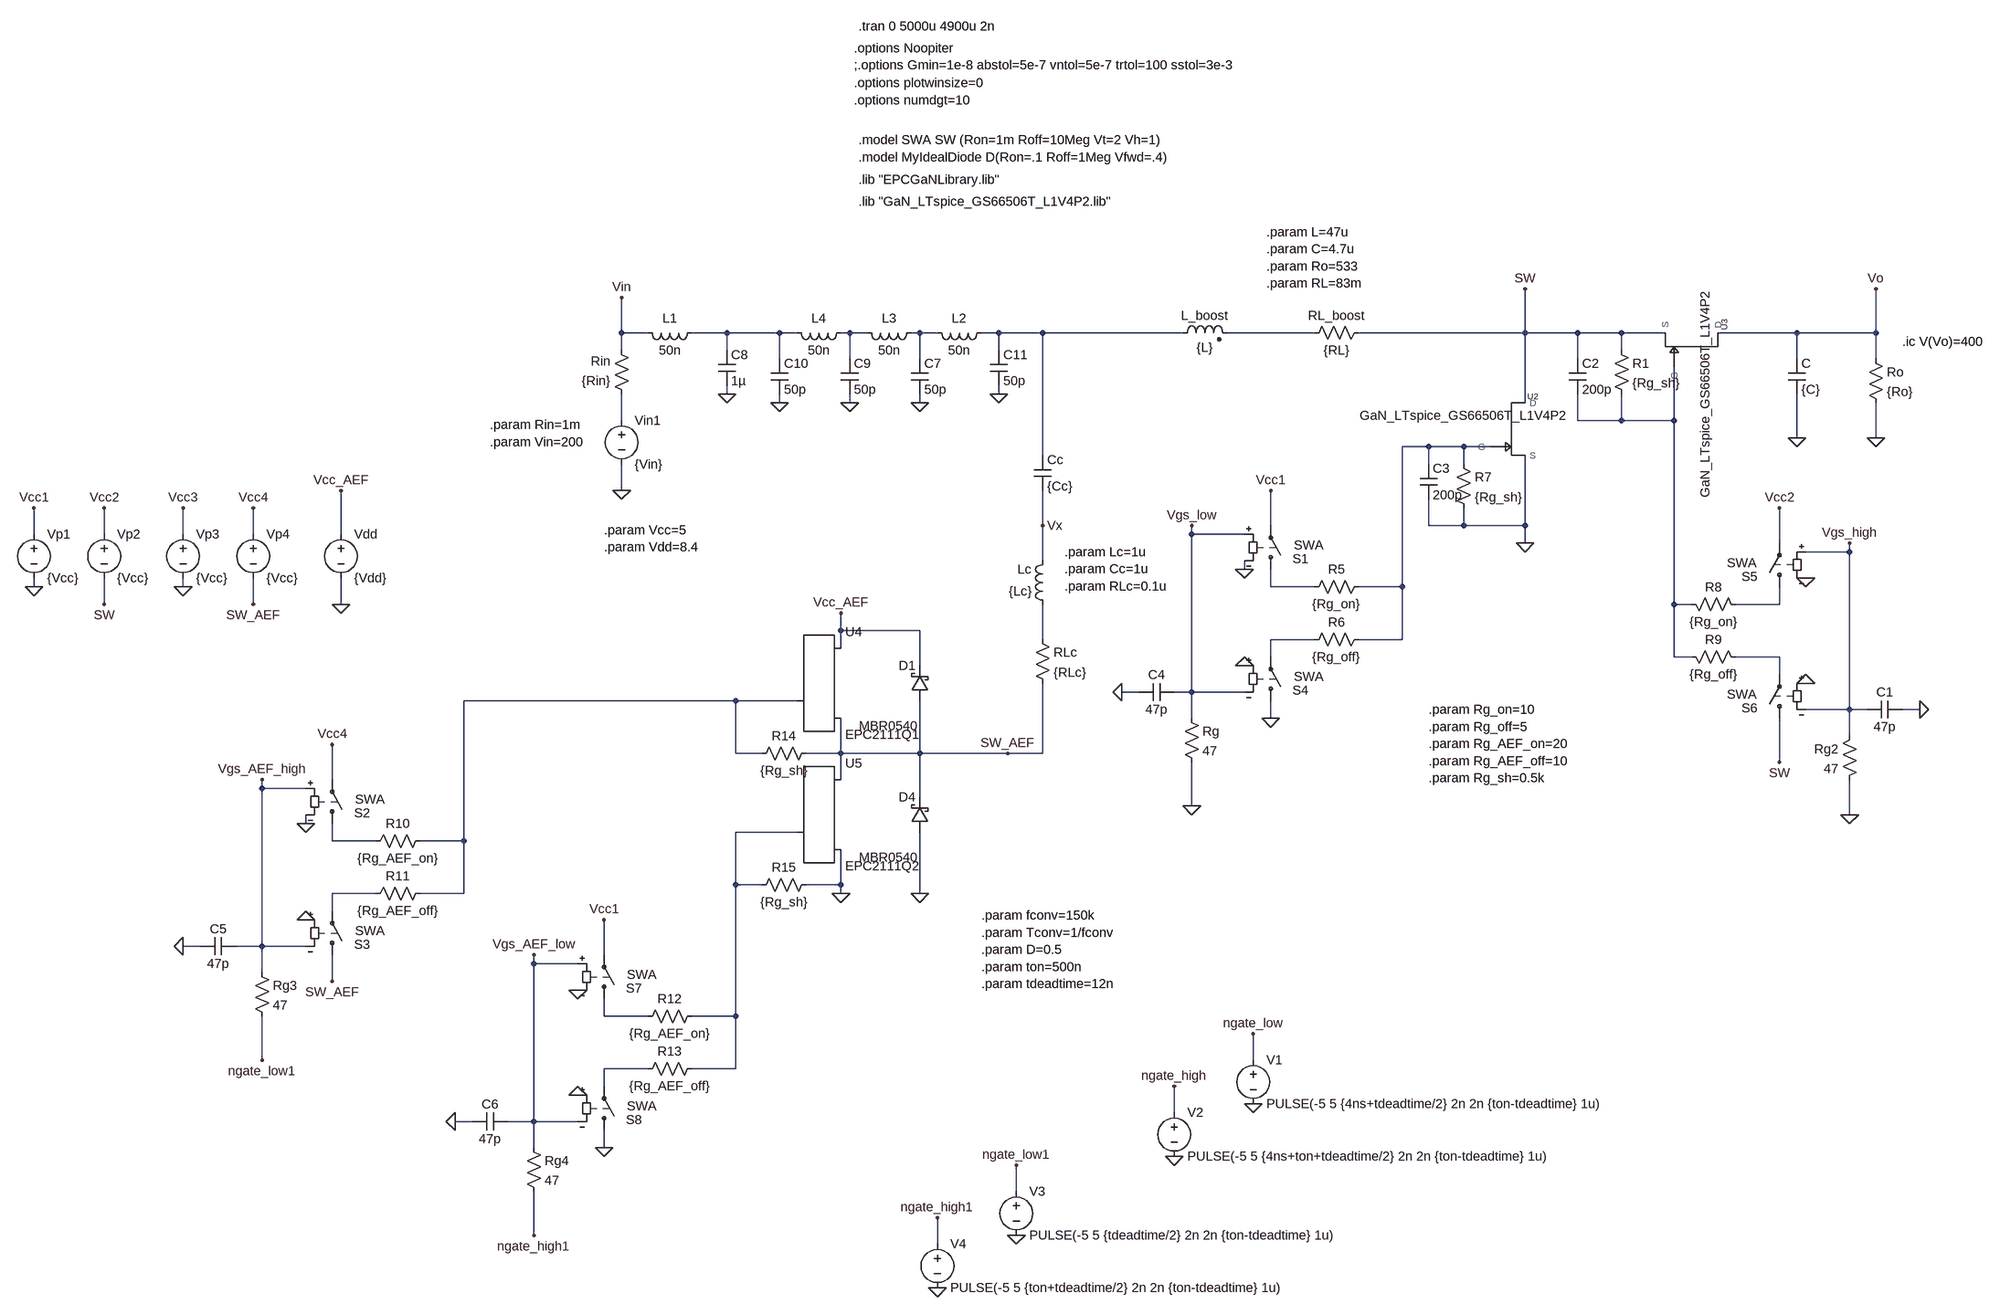
[diagram p0: schematic Boost converter with LC filter -20220425 - 1MHz.asc]
Boost converter with LC filter -20220425 - 1MHz.asc, the LTspice schematic file:
Version 4
SHEET 1 4440 3892
WIRE -1504 640 -1504 576
WIRE -1456 640 -1504 640
WIRE -1312 640 -1376 640
WIRE -1216 640 -1312 640
WIRE -1184 640 -1216 640
WIRE -1088 640 -1104 640
WIRE -1056 640 -1088 640
WIRE -960 640 -976 640
WIRE -928 640 -960 640
WIRE -816 640 -848 640
WIRE -736 640 -816 640
WIRE -480 640 -736 640
WIRE -240 640 -400 640
WIRE 144 640 144 560
WIRE 144 640 -160 640
WIRE 240 640 144 640
WIRE 320 640 240 640
WIRE 400 640 320 640
WIRE 640 640 496 640
WIRE 784 640 784 560
WIRE 784 640 640 640
WIRE -1504 672 -1504 640
WIRE -1312 672 -1312 640
WIRE -816 672 -816 640
WIRE 320 672 320 640
WIRE -1216 688 -1216 640
WIRE -1088 688 -1088 640
WIRE -960 688 -960 640
WIRE 240 688 240 640
WIRE 640 688 640 640
WIRE 784 688 784 640
WIRE -1312 752 -1312 736
WIRE -816 752 -816 736
WIRE -1216 768 -1216 752
WIRE -1088 768 -1088 752
WIRE -960 768 -960 752
WIRE 144 768 144 640
WIRE -1504 800 -1504 752
WIRE 240 800 240 752
WIRE 320 800 320 752
WIRE 320 800 240 800
WIRE 416 800 416 704
WIRE 416 800 320 800
WIRE 640 832 640 752
WIRE 784 832 784 768
WIRE -32 848 -80 848
WIRE 32 848 -32 848
WIRE 80 848 32 848
WIRE -736 864 -736 640
WIRE -32 880 -32 848
WIRE 32 880 32 848
WIRE -1504 928 -1504 880
WIRE -736 992 -736 928
WIRE -320 992 -320 928
WIRE -32 992 -32 944
WIRE 32 992 32 960
WIRE 32 992 -32 992
WIRE 144 992 144 864
WIRE 144 992 32 992
WIRE -2576 1008 -2576 960
WIRE -2448 1008 -2448 960
WIRE -2304 1008 -2304 960
WIRE -2176 1008 -2176 960
WIRE -2016 1008 -2016 928
WIRE -464 1008 -464 992
WIRE -368 1008 -464 1008
WIRE 144 1024 144 992
WIRE 608 1024 608 960
WIRE 736 1040 736 1024
WIRE 736 1040 656 1040
WIRE -736 1056 -736 992
WIRE -368 1072 -368 1056
WIRE -2576 1104 -2576 1088
WIRE -2304 1104 -2304 1088
WIRE -320 1104 -320 1072
WIRE -240 1104 -320 1104
WIRE -80 1104 -80 848
WIRE -80 1104 -160 1104
WIRE -2448 1136 -2448 1088
WIRE -2176 1136 -2176 1088
WIRE -2016 1136 -2016 1088
WIRE 416 1136 416 800
WIRE 448 1136 416 1136
WIRE 608 1136 608 1104
WIRE 608 1136 528 1136
WIRE -1104 1184 -1104 1152
WIRE -960 1184 -1104 1184
WIRE -736 1200 -736 1136
WIRE -240 1200 -320 1200
WIRE -80 1200 -80 1104
WIRE -80 1200 -160 1200
WIRE -1104 1216 -1104 1184
WIRE -320 1232 -320 1200
WIRE 416 1232 416 1136
WIRE 448 1232 416 1232
WIRE 608 1232 528 1232
WIRE -960 1248 -960 1184
WIRE 608 1264 608 1232
WIRE -560 1296 -592 1296
WIRE -464 1296 -464 1008
WIRE -464 1296 -496 1296
WIRE -368 1296 -464 1296
WIRE -1296 1312 -1792 1312
WIRE -1184 1312 -1296 1312
WIRE 736 1328 736 1040
WIRE 736 1328 656 1328
WIRE 768 1328 736 1328
WIRE 864 1328 832 1328
WIRE -464 1344 -464 1296
WIRE -320 1344 -320 1312
WIRE 736 1376 736 1328
WIRE -1296 1408 -1296 1312
WIRE -1248 1408 -1296 1408
WIRE -1104 1408 -1104 1344
WIRE -1104 1408 -1168 1408
WIRE -960 1408 -960 1312
WIRE -960 1408 -1104 1408
WIRE -800 1408 -960 1408
WIRE -736 1408 -736 1280
WIRE -736 1408 -800 1408
WIRE 608 1424 608 1344
WIRE -2032 1456 -2032 1392
WIRE -1104 1456 -1104 1408
WIRE -2160 1472 -2160 1456
WIRE -2080 1472 -2160 1472
WIRE -960 1488 -960 1408
WIRE -464 1504 -464 1424
WIRE 736 1520 736 1456
WIRE -2080 1536 -2080 1520
WIRE -1184 1552 -1296 1552
WIRE -2032 1568 -2032 1536
WIRE -1952 1568 -2032 1568
WIRE -1792 1568 -1792 1312
WIRE -1792 1568 -1872 1568
WIRE -1296 1648 -1296 1552
WIRE -1248 1648 -1296 1648
WIRE -1104 1648 -1104 1584
WIRE -1104 1648 -1168 1648
WIRE -1952 1664 -2032 1664
WIRE -1792 1664 -1792 1568
WIRE -1792 1664 -1872 1664
WIRE -1104 1664 -1104 1648
WIRE -960 1664 -960 1552
WIRE -2032 1696 -2032 1664
WIRE -2272 1760 -2304 1760
WIRE -2160 1760 -2160 1472
WIRE -2160 1760 -2208 1760
WIRE -2080 1760 -2160 1760
WIRE -1536 1776 -1536 1712
WIRE -1664 1792 -1664 1776
WIRE -1584 1792 -1664 1792
WIRE -2160 1808 -2160 1760
WIRE -2032 1824 -2032 1776
WIRE -1536 1888 -1536 1856
WIRE -1456 1888 -1536 1888
WIRE -1296 1888 -1296 1648
WIRE -1296 1888 -1376 1888
WIRE -2160 1968 -2160 1888
WIRE -352 1968 -352 1920
WIRE -1456 1984 -1536 1984
WIRE -1296 1984 -1296 1888
WIRE -1296 1984 -1376 1984
WIRE -1536 2016 -1536 1984
WIRE -496 2064 -496 2016
WIRE -1776 2080 -1808 2080
WIRE -1664 2080 -1664 1792
WIRE -1664 2080 -1712 2080
WIRE -1584 2080 -1664 2080
WIRE -1664 2128 -1664 2080
WIRE -1536 2128 -1536 2096
WIRE -784 2208 -784 2160
WIRE -1664 2288 -1664 2208
WIRE -928 2304 -928 2256
FLAG -1504 928 0
FLAG -368 1072 0
FLAG 640 832 0
FLAG 784 832 0
FLAG -1504 576 Vin
FLAG -464 992 Vgs_low
FLAG 784 560 Vo
FLAG -1104 1152 Vcc_AEF
FLAG -2016 1136 0
FLAG -2016 928 Vcc_AEF
FLAG -736 992 Vx
FLAG -2576 1104 0
FLAG 144 1024 0
FLAG 144 560 SW
FLAG -2576 960 Vcc1
FLAG -2448 960 Vcc2
FLAG -2304 1104 0
FLAG -2304 960 Vcc3
FLAG -2176 960 Vcc4
FLAG -320 928 Vcc1
FLAG -320 1344 0
FLAG 736 1024 Vgs_high
FLAG 608 960 Vcc2
FLAG 608 1424 SW
FLAG -2448 1136 SW
FLAG -1104 1664 0
FLAG -960 1664 0
FLAG -2080 1536 0
FLAG -2160 1456 Vgs_AEF_high
FLAG -2032 1392 Vcc4
FLAG -800 1408 SW_AEF
FLAG -1664 1776 Vgs_AEF_low
FLAG -1536 1712 Vcc1
FLAG -1536 2128 0
FLAG -2176 1136 SW_AEF
FLAG -2032 1824 SW_AEF
FLAG -352 2048 0
FLAG 864 1328 0
FLAG -592 1296 0
FLAG -2160 1968 ngate_low1
FLAG -1664 2288 ngate_high1
FLAG -2304 1760 0
FLAG -1808 2080 0
FLAG 656 1280 0
FLAG -368 1248 0
FLAG -2080 1712 0
FLAG -1584 1840 0
FLAG -1584 2032 0
FLAG 656 1088 0
FLAG -352 1920 ngate_low
FLAG -496 2144 0
FLAG -496 2016 ngate_high
FLAG -784 2288 0
FLAG -784 2160 ngate_low1
FLAG -928 2384 0
FLAG -928 2256 ngate_high1
FLAG -960 768 0
FLAG -464 1504 0
FLAG 736 1520 0
FLAG -1312 752 0
FLAG -1088 768 0
FLAG -1216 768 0
FLAG -816 752 0
SYMBOL voltage -1504 784 R0
WINDOW 123 0 0 Left 2
WINDOW 39 0 0 Left 2
SYMATTR InstName Vin1
SYMATTR Value {Vin}
SYMBOL ind2 -496 656 R270
WINDOW 0 32 56 VTop 2
WINDOW 3 5 56 VBottom 2
SYMATTR InstName L_boost
SYMATTR Value {L}
SYMATTR Type ind
SYMBOL res -1488 768 R180
WINDOW 0 36 76 Left 2
WINDOW 3 36 40 Left 2
SYMATTR InstName Rin
SYMATTR Value {Rin}
SYMBOL sw -320 1088 M180
WINDOW 0 40 35 Left 2
WINDOW 3 42 60 Left 2
SYMATTR InstName S1
SYMATTR Value SWA
SYMBOL cap 624 688 R0
SYMATTR InstName C
SYMATTR Value {C}
SYMBOL res 768 672 R0
SYMATTR InstName Ro
SYMATTR Value {Ro}
SYMBOL res -480 1328 R0
SYMATTR InstName Rg
SYMATTR Value 47
SYMBOL ind -720 1152 R180
WINDOW 0 36 80 Left 2
WINDOW 3 36 40 Left 2
SYMATTR InstName Lc
SYMATTR Value {Lc}
SYMBOL cap -752 864 R0
SYMATTR InstName Cc
SYMATTR Value {Cc}
SYMBOL voltage -2016 992 R0
WINDOW 123 0 0 Left 2
WINDOW 39 0 0 Left 2
SYMATTR InstName Vdd
SYMATTR Value {Vdd}
SYMBOL voltage -2576 992 R0
WINDOW 123 0 0 Left 2
WINDOW 39 0 0 Left 2
SYMATTR InstName Vp1
SYMATTR Value {Vcc}
SYMBOL GaN_LTspice_GS66506T_L1V4P2 96 816 R0
SYMATTR InstName U2
SYMBOL GaN_LTspice_GS66506T_L1V4P2 448 688 M270
SYMATTR InstName U3
SYMBOL EPCGaN -1184 1312 R0
SYMATTR InstName U4
SYMATTR Value EPC2111Q1
SYMBOL EPCGaN -1184 1552 R0
SYMATTR InstName U5
SYMATTR Value EPC2111Q2
SYMBOL voltage -2448 992 R0
WINDOW 123 0 0 Left 2
WINDOW 39 0 0 Left 2
SYMATTR InstName Vp2
SYMATTR Value {Vcc}
SYMBOL voltage -2304 992 R0
WINDOW 123 0 0 Left 2
WINDOW 39 0 0 Left 2
SYMATTR InstName Vp3
SYMATTR Value {Vcc}
SYMBOL voltage -2176 992 R0
WINDOW 123 0 0 Left 2
WINDOW 39 0 0 Left 2
SYMATTR InstName Vp4
SYMATTR Value {Vcc}
SYMBOL res -144 1088 R90
WINDOW 0 0 56 VBottom 2
WINDOW 3 32 56 VTop 2
SYMATTR InstName R5
SYMATTR Value {Rg_on}
SYMBOL sw -320 1328 M180
WINDOW 0 40 35 Left 2
WINDOW 3 42 60 Left 2
SYMATTR InstName S4
SYMATTR Value SWA
SYMBOL res -144 1184 R90
WINDOW 0 0 56 VBottom 2
WINDOW 3 32 56 VTop 2
SYMATTR InstName R6
SYMATTR Value {Rg_off}
SYMBOL res 16 864 R0
SYMATTR InstName R7
SYMATTR Value {Rg_sh}
SYMBOL sw 608 1120 R180
WINDOW 0 40 35 Left 2
WINDOW 3 42 60 Left 2
SYMATTR InstName S5
SYMATTR Value SWA
SYMBOL res 752 1360 M0
SYMATTR InstName Rg2
SYMATTR Value 47
SYMBOL res 432 1120 M90
WINDOW 0 0 56 VBottom 2
WINDOW 3 32 56 VTop 2
SYMATTR InstName R8
SYMATTR Value {Rg_on}
SYMBOL sw 608 1360 R180
WINDOW 0 40 35 Left 2
WINDOW 3 42 60 Left 2
SYMATTR InstName S6
SYMATTR Value SWA
SYMBOL res 432 1216 M90
WINDOW 0 0 56 VBottom 2
WINDOW 3 32 56 VTop 2
SYMATTR InstName R9
SYMATTR Value {Rg_off}
SYMBOL schottky -944 1312 R180
WINDOW 0 24 64 Left 2
WINDOW 3 20 -46 Left 2
SYMATTR InstName D1
SYMATTR Value MBR0540
SYMATTR Description Diode
SYMATTR Type diode
SYMBOL schottky -944 1552 R180
WINDOW 0 24 64 Left 2
WINDOW 3 20 -46 Left 2
SYMATTR InstName D4
SYMATTR Value MBR0540
SYMATTR Description Diode
SYMATTR Type diode
SYMBOL sw -2032 1552 M180
WINDOW 0 40 35 Left 2
WINDOW 3 42 60 Left 2
SYMATTR InstName S2
SYMATTR Value SWA
SYMBOL res -2176 1792 R0
SYMATTR InstName Rg3
SYMATTR Value 47
SYMBOL res -1856 1552 R90
WINDOW 0 0 56 VBottom 2
WINDOW 3 32 56 VTop 2
SYMATTR InstName R10
SYMATTR Value {Rg_AEF_on}
SYMBOL sw -2032 1792 M180
WINDOW 0 40 35 Left 2
WINDOW 3 42 60 Left 2
SYMATTR InstName S3
SYMATTR Value SWA
SYMBOL res -1856 1648 R90
WINDOW 0 0 56 VBottom 2
WINDOW 3 32 56 VTop 2
SYMATTR InstName R11
SYMATTR Value {Rg_AEF_off}
SYMBOL sw -1536 1872 M180
WINDOW 0 40 35 Left 2
WINDOW 3 42 60 Left 2
SYMATTR InstName S7
SYMATTR Value SWA
SYMBOL res -1680 2112 R0
SYMATTR InstName Rg4
SYMATTR Value 47
SYMBOL res -1360 1872 R90
WINDOW 0 0 56 VBottom 2
WINDOW 3 32 56 VTop 2
SYMATTR InstName R12
SYMATTR Value {Rg_AEF_on}
SYMBOL sw -1536 2112 M180
WINDOW 0 40 35 Left 2
WINDOW 3 42 60 Left 2
SYMATTR InstName S8
SYMATTR Value SWA
SYMBOL res -1360 1968 R90
WINDOW 0 0 56 VBottom 2
WINDOW 3 32 56 VTop 2
SYMATTR InstName R13
SYMATTR Value {Rg_AEF_off}
SYMBOL res -1152 1392 R90
WINDOW 0 0 56 VBottom 2
WINDOW 3 32 56 VTop 2
SYMATTR InstName R14
SYMATTR Value {Rg_sh}
SYMBOL res -1152 1632 R90
WINDOW 0 0 56 VBottom 2
WINDOW 3 32 56 VTop 2
SYMATTR InstName R15
SYMATTR Value {Rg_sh}
SYMBOL voltage -352 1952 R0
WINDOW 123 0 0 Left 2
WINDOW 39 0 0 Left 2
SYMATTR InstName V1
SYMATTR Value PULSE(-5 5 {4ns+tdeadtime/2} 2n 2n {ton-tdeadtime} 1u)
SYMBOL res 304 656 R0
SYMATTR InstName R1
SYMATTR Value {Rg_sh}
SYMBOL res -752 1184 R0
SYMATTR InstName RLc
SYMATTR Value {RLc}
SYMBOL res -144 624 R90
WINDOW 0 0 56 VBottom 2
WINDOW 3 32 56 VTop 2
SYMATTR InstName RL_boost
SYMATTR Value {RL}
SYMBOL cap 832 1312 R90
WINDOW 0 0 32 VBottom 2
WINDOW 3 32 32 VTop 2
SYMATTR InstName C1
SYMATTR Value 47p
SYMBOL cap 224 688 R0
SYMATTR InstName C2
SYMATTR Value 200p
SYMBOL cap -48 880 R0
SYMATTR InstName C3
SYMATTR Value 200p
SYMBOL cap -496 1280 R90
WINDOW 0 0 32 VBottom 2
WINDOW 3 32 32 VTop 2
SYMATTR InstName C4
SYMATTR Value 47p
SYMBOL cap -2208 1744 R90
WINDOW 0 0 32 VBottom 2
WINDOW 3 32 32 VTop 2
SYMATTR InstName C5
SYMATTR Value 47p
SYMBOL cap -1712 2064 R90
WINDOW 0 0 32 VBottom 2
WINDOW 3 32 32 VTop 2
SYMATTR InstName C6
SYMATTR Value 47p
SYMBOL voltage -496 2048 R0
WINDOW 123 0 0 Left 2
WINDOW 39 0 0 Left 2
SYMATTR InstName V2
SYMATTR Value PULSE(-5 5 {4ns+ton+tdeadtime/2} 2n 2n {ton-tdeadtime} 1u)
SYMBOL voltage -784 2192 R0
WINDOW 123 0 0 Left 2
WINDOW 39 0 0 Left 2
SYMATTR InstName V3
SYMATTR Value PULSE(-5 5 {tdeadtime/2} 2n 2n {ton-tdeadtime} 1u)
SYMBOL voltage -928 2288 R0
WINDOW 123 0 0 Left 2
WINDOW 39 0 0 Left 2
SYMATTR InstName V4
SYMATTR Value PULSE(-5 5 {ton+tdeadtime/2} 2n 2n {ton-tdeadtime} 1u)
SYMBOL cap -976 688 R0
SYMATTR InstName C7
SYMATTR Value 50p
SYMBOL ind -1360 624 R90
WINDOW 0 5 56 VBottom 2
WINDOW 3 32 56 VTop 2
SYMATTR InstName L1
SYMATTR Value 50n
SYMBOL ind -832 624 R90
WINDOW 0 5 56 VBottom 2
WINDOW 3 32 56 VTop 2
SYMATTR InstName L2
SYMATTR Value 50n
SYMBOL cap -1328 672 R0
SYMATTR InstName C8
SYMATTR Value 1µ
SYMBOL cap -1104 688 R0
SYMATTR InstName C9
SYMATTR Value 50p
SYMBOL ind -960 624 R90
WINDOW 0 5 56 VBottom 2
WINDOW 3 32 56 VTop 2
SYMATTR InstName L3
SYMATTR Value 50n
SYMBOL cap -1232 688 R0
SYMATTR InstName C10
SYMATTR Value 50p
SYMBOL ind -1088 624 R90
WINDOW 0 5 56 VBottom 2
WINDOW 3 32 56 VTop 2
SYMATTR InstName L4
SYMATTR Value 50n
SYMBOL cap -832 672 R0
SYMATTR InstName C11
SYMATTR Value 50p
TEXT -848 1704 Left 2 !.param fconv=150k \n.param Tconv=1/fconv\n.param D=0.5\n.param ton=500n\n.param tdeadtime=12n
TEXT -1080 120 Left 2 !.options Noopiter\n;.options Gmin=1e-8 abstol=5e-7 vntol=5e-7 trtol=100 sstol=3e-3
TEXT -1072 80 Left 2 !.tran 0 5000u 4900u 2n
TEXT -1080 184 Left 2 !.options plotwinsize=0\n.options numdgt=10
TEXT -1072 288 Left 2 !.model SWA SW (Ron=1m Roff=10Meg Vt=2 Vh=1)\n.model MyIdealDiode D(Ron=.1 Roff=1Meg Vfwd=.4)
TEXT -1744 808 Left 2 !.param Rin=1m\n.param Vin=200
TEXT -328 456 Left 2 !.param L=47u\n.param C=4.7u\n.param Ro=533\n.param RL=83m
TEXT 832 656 Left 2 !.ic V(Vo)=400
TEXT -1072 360 Left 2 !.lib "EPCGaNLibrary.lib"
TEXT -1072 400 Left 2 !.lib "GaN_LTspice_GS66506T_L1V4P2.lib"
TEXT -1536 1000 Left 2 !.param Vcc=5\n.param Vdd=8.4
TEXT -32 1328 Left 2 !.param Rg_on=10\n.param Rg_off=5\n.param Rg_AEF_on=20\n.param Rg_AEF_off=10\n.param Rg_sh=0.5k
TEXT -696 1040 Left 2 !.param Lc=1u\n.param Cc=1u\n.param RLc=0.1u

The netlist it stands for:
* Boost converter with LC filter -20220425 - 1MHz.asc
Vin1 N006 0 {Vin}
L_boost N004 N005 {L}
Rin N006 Vin {Rin}
S1 N009 Vcc1 Vgs_low 0 SWA
C Vo 0 {C}
Ro Vo 0 {Ro}
Rg Vgs_low 0 47
Lc N011 Vx {Lc}
Cc N004 Vx {Cc}
Vdd Vcc_AEF 0 {Vdd}
Vp1 Vcc1 0 {Vcc}
XU2 N008 SW 0 GaN_LTspice_GS66506T_L1V4P2  ; pins G D S
XU3 N007 Vo SW GaN_LTspice_GS66506T_L1V4P2  ; pins G D S
XU4 N014 Vcc_AEF SW_AEF EPC2111Q1
XU5 N015 SW_AEF 0 EPC2111Q2
Vp2 Vcc2 SW {Vcc}
Vp3 Vcc3 0 {Vcc}
Vp4 Vcc4 SW_AEF {Vcc}
R5 N008 N009 {Rg_on}
S4 0 N012 0 Vgs_low SWA
R6 N008 N012 {Rg_off}
R7 N008 0 {Rg_sh}
S5 N010 Vcc2 Vgs_high 0 SWA
Rg2 Vgs_high 0 47
R8 N007 N010 {Rg_on}
S6 SW N013 0 Vgs_high SWA
R9 N007 N013 {Rg_off}
D1 SW_AEF Vcc_AEF MBR0540
D4 0 SW_AEF MBR0540
S2 N016 Vcc4 Vgs_AEF_high 0 SWA
Rg3 Vgs_AEF_high ngate_low1 47
R10 N014 N016 {Rg_AEF_on}
S3 SW_AEF N017 0 Vgs_AEF_high SWA
R11 N014 N017 {Rg_AEF_off}
S7 N018 Vcc1 Vgs_AEF_low 0 SWA
Rg4 Vgs_AEF_low ngate_high1 47
R12 N015 N018 {Rg_AEF_on}
S8 0 N019 0 Vgs_AEF_low SWA
R13 N015 N019 {Rg_AEF_off}
R14 SW_AEF N014 {Rg_sh}
R15 0 N015 {Rg_sh}
V1 ngate_low 0 PULSE(-5 5 {4ns+tdeadtime/2} 2n 2n {ton-tdeadtime} 1u)
R1 SW N007 {Rg_sh}
RLc N011 SW_AEF {RLc}
RL_boost SW N005 {RL}
C1 0 Vgs_high 47p
C2 SW N007 200p
C3 N008 0 200p
C4 Vgs_low 0 47p
C5 Vgs_AEF_high 0 47p
C6 Vgs_AEF_low 0 47p
V2 ngate_high 0 PULSE(-5 5 {4ns+ton+tdeadtime/2} 2n 2n {ton-tdeadtime} 1u)
V3 ngate_low1 0 PULSE(-5 5 {tdeadtime/2} 2n 2n {ton-tdeadtime} 1u)
V4 ngate_high1 0 PULSE(-5 5 {ton+tdeadtime/2} 2n 2n {ton-tdeadtime} 1u)
C7 N003 0 50p
L1 N001 Vin 50n
L2 N004 N003 50n
C8 N001 0 1µ
C9 N002 0 50p
L3 N003 N002 50n
C10 N001 0 50p
L4 N002 N001 50n
C11 N004 0 50p
.model D D
.lib standard.dio
.param fconv=150k
.param Tconv=1/fconv
.param D=0.5
.param ton=500n
.param tdeadtime=12n
.options Noopiter
;.options Gmin=1e-8 abstol=5e-7 vntol=5e-7 trtol=100 sstol=3e-3
.tran 0 5000u 4900u 2n
.options plotwinsize=0
.options numdgt=10
.model SWA SW (Ron=1m Roff=10Meg Vt=2 Vh=1)
.model MyIdealDiode D(Ron=.1 Roff=1Meg Vfwd=.4)
.param Rin=1m
.param Vin=200
.param L=47u
.param C=4.7u
.param Ro=533
.param RL=83m
.ic V(Vo)=400
.lib "EPCGaNLibrary.lib"
.lib "GaN_LTspice_GS66506T_L1V4P2.lib"
.param Vcc=5
.param Vdd=8.4
.param Rg_on=10
.param Rg_off=5
.param Rg_AEF_on=20
.param Rg_AEF_off=10
.param Rg_sh=0.5k
.param Lc=1u
.param Cc=1u
.param RLc=0.1u
.lib GaN_LTspice_GS66506T_L1V4P2.lib
.backanno
.end